# Altium schematic sheet Schematic.SchDoc: Mach on ap 5V
size A4; Author: DONG KHOA; DrawnBy: DONG KHOA; SheetNumber: 1; SheetTotal: 1
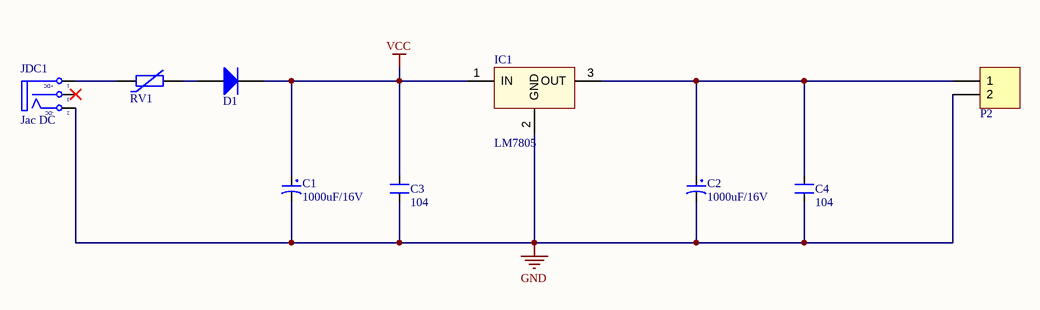
[diagram p0: Schematic.SchDoc]

## Parts
C1  1000uF/16V  [CP1.5/3.4]
C2  1000uF/16V  [CP1.5/3.4]
C3  104  [CN2]
C4  104  [CN2]
D1  Diode  [D1A]  (value not drawn)
IC1  LM7805  [QTO-220]
JDC1  Jac DC  [DC-IN]
P2  Domino 2  [DOMINO 2- 5mm]  (value not drawn)
RV1  14VAC, 18VDC  [D9W4.5H12P0.8]  (value not drawn)

## Nets
GND: C1.2 C2.2 C3.1 C4.1 IC1.2(GND) JDC1.2(TN) P2.2
VCC: C1.1 C3.2 D1.2(K) IC1.1(IN)
NetC2_1: C2.1 C4.2 IC1.3(OUT) P2.1
NetD1_1: D1.1(A) RV1.2
NetJDC1_1: JDC1.1(T) RV1.1

Not connected (* = marked no-connect by the designer): JDC1 3(S)*

## Notes on the sheet
- THIS DOCUMENT AND THE DATA DISCLOSED HEREIN OR
- HEREWITH IS THE PROPERTY OF ALTIUM LIMITED AND MAY
- DWG NO:
- REVISION
- REV:
- DESCRIPTION
- DATE
- APPROVED
- BE FREELY DISTRIBUTED IN WHOLE. NO RIGHTS ARE
- RESERVED OR EXPRESS OR IMPLIED WARANTEE GIVEN.
- ENG:
- APPROVALS
- PROJECT
- DSN:
- CHK:
- REFERENCE DOCUMENTS
- PROJECT REVISION:
- TITLE
- DOCUMENT REVISION:
- DESIGN ITEM:
- BOM:
- FAB DWG:
- PCB DWG:
- ASSY DWG:
- SCALE:
- A3
- SIZE
- CAGE CODE
- FILE NAME
- DWG NO.
- SHEET
- OF
- REV
- (in symbol DCIN) +DC; -DC

## Library data of the parts
C1 C2 = CP4: Cap 1000uF/16V - 220uF/50V; Description 5: 4,7uF>10uF/250V_3,3uF>10uF/400V - 2,2uF>4,7uF/450V; Description 1: 2200uF-3300uF/6,3V - 1000uF-2200uF/10V; Description 2: 1000uF/16V - 470uF => 1000uF/25V - 100uF/100V; Description 3: 330uF>470uF/35V_220uF>470uF/50V_10uF>22uF/250V; Description 4: 220uF => 330uF/63V - 10uF =>33uF/160 - 200V; Value: 1000uF/16V
C3 C4 = CN2: Cap np 104 => 105pF; Value: 0.1uF
D1 = Diode: Default Diode
IC1 = LM78xx: On ap +, from + 5 to + 24VDC; Value: LM7805
JDC1 = DCIN: Jac DC input; Value: Jac DC
P2 = Domino 2: Domino, 2-Pin; LatestRevisionDate: 17-Jul-2002; LatestRevisionNote: Re-released for DXP Platform.; Publisher: Altium Limited
RV1 = 820571406: WE-VD Disk Varistor, THT, 14VAC, 18VDC, 2930pF; Manufacturer: Wurth Elektronik; Clamping Voltage: 43V; Energy Absorption: 1.4J; Operating Voltage (AC): 14V; Operating Voltage (DC): 18V; Pitch: 0.8mm; Power Dissipation: 0.02W; (Reverse) Breakdown Voltage: 22V; (Reverse) Peak Pulse Current: 250A; Manufacturer Part Number: 820571406; Category: Surge Protection; Match Code: WE-VD; ComponentLink1Description: Website Link; ComponentLink1URL: https://www.we-online.com/redexpert/article/820571406?ad; ComponentLink2Description: Datasheet Link; ComponentLink2URL: https://www.we-online.com/redexpert/spec/820571406?ad; Mount: Through Hole; Operating Temperature Max: 85°C; Operating Temperature Min: -40°C; Packaging: Tape and Reel; Width: 4.5mm; Height: 12mm; Diameter: 9mm; Channel Input Capacitance: 2930pF